# Altium schematic sheet SoundChip.SchDoc
size A
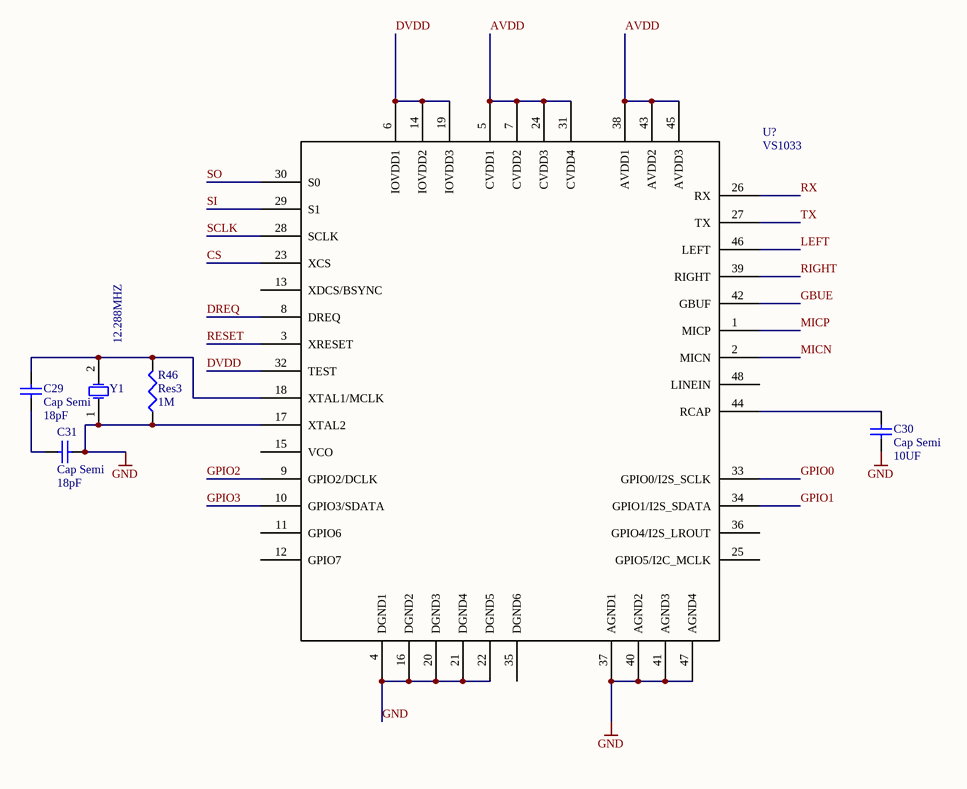
[diagram p0: SoundChip.SchDoc]

## Parts
C29  Cap Semi  value 18pF  [CAPC3216L]
C30  Cap Semi  value 10UF  [CAPC3216L]
C31  Cap Semi  value 18pF  [CAPC3216L]
R46  Res3  value 1M  [RESC1608L]
U?  VS1033  [LQFP-48]
Y1  12.288MHZ  [BCY-W2/D3.1]

## Nets
GND: C30.1 C31.1 R46.1 U?.4(DGND1) U?.16(DGND2) U?.17(XTAL2) U?.20(DGND3) U?.21(DGND4) U?.22(DGND5) U?.37(AGND1) U?.40(AGND2) U?.41(AGND3) U?.47(AGND4) Y1.1(OSC1)
AVDD: U?.5(CVDD1) U?.7(CVDD2) U?.24(CVDD3) U?.31(CVDD4) U?.38(AVDD1) U?.43(AVDD2) U?.45(AVDD3)
CS: U?.23(XCS)
DREQ: U?.8(DREQ)
DVDD: U?.6(IOVDD1) U?.14(IOVDD2) U?.19(IOVDD3) U?.32(TEST)
GBUE: U?.42(GBUF)
GPIO0: U?.33(GPIO0/I2S_SCLK)
GPIO1: U?.34(GPIO1/I2S_SDATA)
GPIO2: U?.9(GPIO2/DCLK)
GPIO3: U?.10(GPIO3/SDATA)
LEFT: U?.46(LEFT)
MICN: U?.2(MICN)
MICP: U?.1(MICP)
RESET: U?.3(XRESET)
RIGHT: U?.39(RIGHT)
RX: U?.26(RX)
SCLK: U?.28(SCLK)
SI: U?.29(S1)
SO: U?.30(S0)
TX: U?.27(TX)
NetC29_1: C29.1 C31.2
NetC29_2: C29.2 R46.2 U?.18(XTAL1/MCLK) Y1.2(OSC2)
NetC30_2: C30.2 U?.44(RCAP)

Not connected (* = marked no-connect by the designer): U? 11(GPIO6) 12(GPIO7) 13(XDCS/BSYNC) 15(VCO) 25(GPIO5/I2C_MCLK) 35(DGND6) 36(GPIO4/I2S_LROUT) 48(LINEIN)

## Library data of the parts
C29-C31 = Cap Semi: Capacitor (Semiconductor SIM Model); Published: 8-Jun-2000; LatestRevisionDate: 29-May-2009; LatestRevisionNote: IPC-7351 Footprint Added.; PackageReference: C1206; Publisher: Altium Limited; PackageDescription: Chip Capacitor
R46 = Res3: Resistor; Published: 8-Jun-2000; LatestRevisionDate: 29-May-2009; LatestRevisionNote: IPC-7351 Footprint Added.; PackageReference: J1-0603; Publisher: Altium Limited; PackageDescription: Chip Resistor
Y1 = XTAL: Crystal Oscillator; Published: 8-Jun-2000; LatestRevisionDate: 17-Jul-2002; LatestRevisionNote: Re-released for DXP Platform.; PackageReference: R38; Publisher: Altium Limited